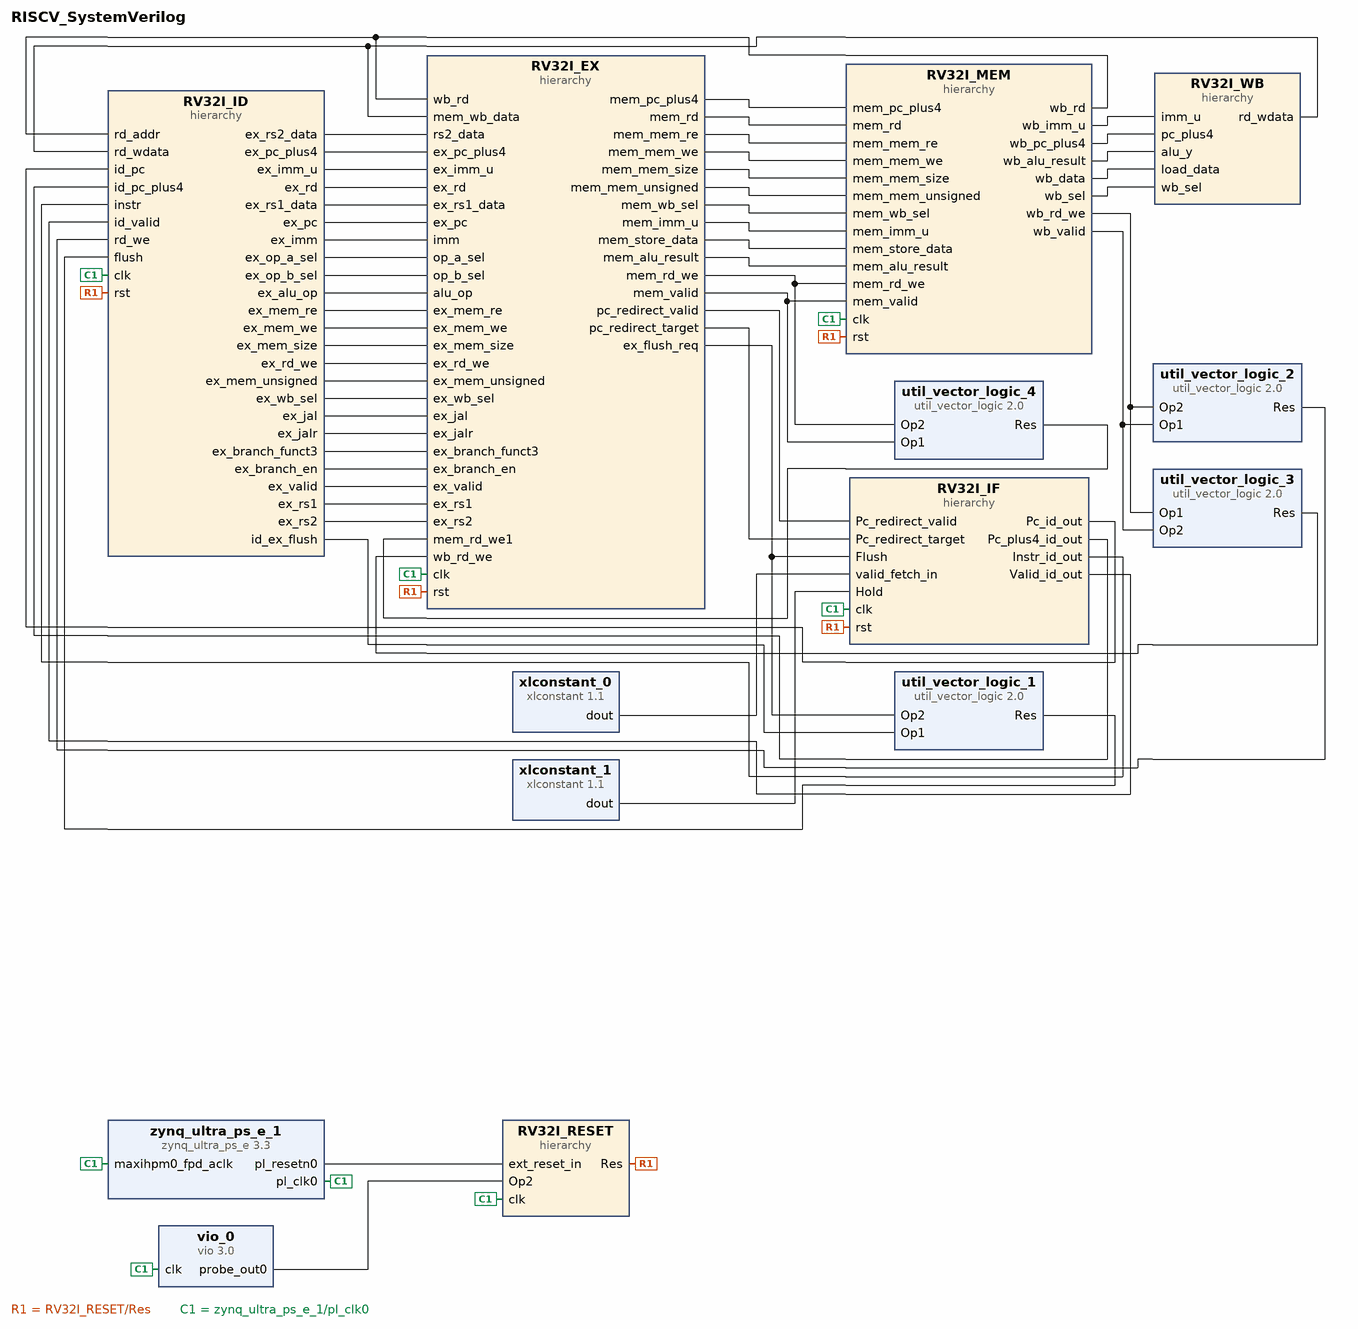
[diagram p0: block diagram of the top level]
# Vivado block design RISCV_SystemVerilog, xczu5ev-sfvc784-2-i, Vivado 2020.1
create_bd_design RISCV_SystemVerilog

create_bd_cell -type hier RV32I_IF
create_bd_cell -type hier RV32I_ID
create_bd_cell -type ip -vlnv xilinx.com:ip:xlconstant:1.1 xlconstant_0
create_bd_cell -type hier RV32I_EX
create_bd_cell -type hier RV32I_MEM
create_bd_cell -type hier RV32I_WB
create_bd_cell -type hier RV32I_RESET
create_bd_cell -type ip -vlnv xilinx.com:ip:zynq_ultra_ps_e:3.3 zynq_ultra_ps_e_1
set_property -dict [list \
  CONFIG.CAN0_BOARD_INTERFACE custom \
  CONFIG.CAN1_BOARD_INTERFACE custom \
  CONFIG.CSU_BOARD_INTERFACE custom \
  CONFIG.DP_BOARD_INTERFACE custom \
  CONFIG.GEM0_BOARD_INTERFACE custom \
  CONFIG.GEM1_BOARD_INTERFACE custom \
  CONFIG.GEM2_BOARD_INTERFACE custom \
  CONFIG.GEM3_BOARD_INTERFACE custom \
  CONFIG.GPIO_BOARD_INTERFACE custom \
  CONFIG.IIC0_BOARD_INTERFACE custom \
  CONFIG.IIC1_BOARD_INTERFACE custom \
  CONFIG.NAND_BOARD_INTERFACE custom \
  CONFIG.PCIE_BOARD_INTERFACE custom \
  CONFIG.PJTAG_BOARD_INTERFACE custom \
  CONFIG.PMU_BOARD_INTERFACE custom \
  CONFIG.PSU_BANK_0_IO_STANDARD LVCMOS18 \
  CONFIG.PSU_BANK_1_IO_STANDARD LVCMOS18 \
  CONFIG.PSU_BANK_2_IO_STANDARD LVCMOS18 \
  CONFIG.PSU_BANK_3_IO_STANDARD LVCMOS18 \
  CONFIG.PSU_USB3__DUAL_CLOCK_ENABLE 1 \
  CONFIG.PSU__CAN0__PERIPHERAL__ENABLE 1 \
  CONFIG.PSU__CAN0__PERIPHERAL__IO EMIO \
  CONFIG.PSU__CAN1__PERIPHERAL__ENABLE 0 \
  CONFIG.PSU__CRF_APB__ACPU_CTRL__FREQMHZ 1200 \
  CONFIG.PSU__CRF_APB__ACPU_CTRL__SRCSEL APLL \
  CONFIG.PSU__CRF_APB__APLL_CTRL__SRCSEL PSS_REF_CLK \
  CONFIG.PSU__CRF_APB__DBG_FPD_CTRL__FREQMHZ 250 \
  CONFIG.PSU__CRF_APB__DBG_FPD_CTRL__SRCSEL IOPLL \
  CONFIG.PSU__CRF_APB__DBG_TRACE_CTRL__FREQMHZ 250 \
  CONFIG.PSU__CRF_APB__DBG_TRACE_CTRL__SRCSEL IOPLL \
  CONFIG.PSU__CRF_APB__DBG_TSTMP_CTRL__FREQMHZ 250 \
  CONFIG.PSU__CRF_APB__DBG_TSTMP_CTRL__SRCSEL IOPLL \
  CONFIG.PSU__CRF_APB__DDR_CTRL__FREQMHZ 1200 \
  CONFIG.PSU__CRF_APB__DDR_CTRL__SRCSEL DPLL \
  CONFIG.PSU__CRF_APB__DPDMA_REF_CTRL__FREQMHZ 600 \
  CONFIG.PSU__CRF_APB__DPDMA_REF_CTRL__SRCSEL DPLL \
  CONFIG.PSU__CRF_APB__DPLL_CTRL__SRCSEL PSS_REF_CLK \
  CONFIG.PSU__CRF_APB__DP_AUDIO_REF_CTRL__SRCSEL RPLL \
  CONFIG.PSU__CRF_APB__DP_STC_REF_CTRL__SRCSEL RPLL \
  CONFIG.PSU__CRF_APB__DP_VIDEO_REF_CTRL__SRCSEL VPLL \
  CONFIG.PSU__CRF_APB__GDMA_REF_CTRL__FREQMHZ 600 \
  CONFIG.PSU__CRF_APB__GDMA_REF_CTRL__SRCSEL DPLL \
  CONFIG.PSU__CRF_APB__GPU_REF_CTRL__FREQMHZ 600 \
  CONFIG.PSU__CRF_APB__GPU_REF_CTRL__SRCSEL DPLL \
  CONFIG.PSU__CRF_APB__TOPSW_LSBUS_CTRL__FREQMHZ 100 \
  CONFIG.PSU__CRF_APB__TOPSW_LSBUS_CTRL__SRCSEL IOPLL \
  CONFIG.PSU__CRF_APB__TOPSW_MAIN_CTRL__FREQMHZ 533.333 \
  CONFIG.PSU__CRF_APB__TOPSW_MAIN_CTRL__SRCSEL DPLL \
  CONFIG.PSU__CRF_APB__VPLL_CTRL__SRCSEL PSS_REF_CLK \
  CONFIG.PSU__CRL_APB__ADMA_REF_CTRL__FREQMHZ 500 \
  CONFIG.PSU__CRL_APB__ADMA_REF_CTRL__SRCSEL IOPLL \
  CONFIG.PSU__CRL_APB__CAN1_REF_CTRL__FREQMHZ 100 \
  CONFIG.PSU__CRL_APB__CAN1_REF_CTRL__SRCSEL IOPLL \
  CONFIG.PSU__CRL_APB__CPU_R5_CTRL__FREQMHZ 500 \
  CONFIG.PSU__CRL_APB__CPU_R5_CTRL__SRCSEL IOPLL \
  CONFIG.PSU__CRL_APB__DBG_LPD_CTRL__FREQMHZ 250 \
  CONFIG.PSU__CRL_APB__DBG_LPD_CTRL__SRCSEL IOPLL \
  CONFIG.PSU__CRL_APB__GEM3_REF_CTRL__FREQMHZ 125 \
  CONFIG.PSU__CRL_APB__GEM3_REF_CTRL__SRCSEL IOPLL \
  CONFIG.PSU__CRL_APB__I2C0_REF_CTRL__FREQMHZ 100 \
  CONFIG.PSU__CRL_APB__I2C0_REF_CTRL__SRCSEL IOPLL \
  CONFIG.PSU__CRL_APB__I2C1_REF_CTRL__FREQMHZ 100 \
  CONFIG.PSU__CRL_APB__I2C1_REF_CTRL__SRCSEL IOPLL \
  CONFIG.PSU__CRL_APB__IOPLL_CTRL__SRCSEL PSS_REF_CLK \
  CONFIG.PSU__CRL_APB__IOU_SWITCH_CTRL__FREQMHZ 267 \
  CONFIG.PSU__CRL_APB__IOU_SWITCH_CTRL__SRCSEL RPLL \
  CONFIG.PSU__CRL_APB__LPD_LSBUS_CTRL__FREQMHZ 100 \
  CONFIG.PSU__CRL_APB__LPD_LSBUS_CTRL__SRCSEL IOPLL \
  CONFIG.PSU__CRL_APB__LPD_SWITCH_CTRL__FREQMHZ 500 \
  CONFIG.PSU__CRL_APB__LPD_SWITCH_CTRL__SRCSEL IOPLL \
  CONFIG.PSU__CRL_APB__PCAP_CTRL__FREQMHZ 200 \
  CONFIG.PSU__CRL_APB__PCAP_CTRL__SRCSEL IOPLL \
  CONFIG.PSU__CRL_APB__PL0_REF_CTRL__FREQMHZ 10 \
  CONFIG.PSU__CRL_APB__PL0_REF_CTRL__SRCSEL RPLL \
  CONFIG.PSU__CRL_APB__PL1_REF_CTRL__FREQMHZ 10 \
  CONFIG.PSU__CRL_APB__QSPI_REF_CTRL__FREQMHZ 300 \
  CONFIG.PSU__CRL_APB__QSPI_REF_CTRL__SRCSEL IOPLL \
  CONFIG.PSU__CRL_APB__RPLL_CTRL__SRCSEL PSS_REF_CLK \
  CONFIG.PSU__CRL_APB__SDIO1_REF_CTRL__FREQMHZ 200 \
  CONFIG.PSU__CRL_APB__SDIO1_REF_CTRL__SRCSEL RPLL \
  CONFIG.PSU__CRL_APB__TIMESTAMP_REF_CTRL__FREQMHZ 100 \
  CONFIG.PSU__CRL_APB__TIMESTAMP_REF_CTRL__SRCSEL PSS_REF_CLK \
  CONFIG.PSU__CRL_APB__UART0_REF_CTRL__FREQMHZ 100 \
  CONFIG.PSU__CRL_APB__UART0_REF_CTRL__SRCSEL IOPLL \
  CONFIG.PSU__CRL_APB__UART1_REF_CTRL__FREQMHZ 100 \
  CONFIG.PSU__CRL_APB__UART1_REF_CTRL__SRCSEL IOPLL \
  CONFIG.PSU__CRL_APB__USB0_BUS_REF_CTRL__FREQMHZ 250 \
  CONFIG.PSU__CRL_APB__USB0_BUS_REF_CTRL__SRCSEL IOPLL \
  CONFIG.PSU__CRL_APB__USB3_DUAL_REF_CTRL__FREQMHZ 20 \
  CONFIG.PSU__CRL_APB__USB3_DUAL_REF_CTRL__SRCSEL IOPLL \
  CONFIG.PSU__CRL_APB__USB3__ENABLE 1 \
  CONFIG.PSU__CSUPMU__PERIPHERAL__VALID 0 \
  CONFIG.PSU__DDRC__BUS_WIDTH {64 Bit} \
  CONFIG.PSU__DDRC__COMPONENTS Components \
  CONFIG.PSU__DDRC__DEVICE_CAPACITY {8192 MBits} \
  CONFIG.PSU__DDRC__DRAM_WIDTH {16 Bits} \
  CONFIG.PSU__DDRC__ECC Disabled \
  CONFIG.PSU__DDRC__MEMORY_TYPE {DDR 4} \
  CONFIG.PSU__DDRC__SPEED_BIN DDR4_2400R \
  CONFIG.PSU__DDR_HIGH_ADDRESS_GUI_ENABLE 1 \
  CONFIG.PSU__DDR__INTERFACE__FREQMHZ 600.000 \
  CONFIG.PSU__DEVICE_TYPE EV \
  CONFIG.PSU__DISPLAYPORT__LANE0__ENABLE 1 \
  CONFIG.PSU__DISPLAYPORT__LANE0__IO {GT Lane3} \
  CONFIG.PSU__DISPLAYPORT__LANE1__ENABLE 0 \
  CONFIG.PSU__DISPLAYPORT__PERIPHERAL__ENABLE 1 \
  CONFIG.PSU__DLL__ISUSED 1 \
  CONFIG.PSU__DPAUX__PERIPHERAL__ENABLE 1 \
  CONFIG.PSU__DPAUX__PERIPHERAL__IO {MIO 27 .. 30} \
  CONFIG.PSU__DP__LANE_SEL {Single Higher} \
  CONFIG.PSU__DP__REF_CLK_FREQ 108 \
  CONFIG.PSU__DP__REF_CLK_SEL {Ref Clk3} \
  CONFIG.PSU__ENET3__FIFO__ENABLE 0 \
  CONFIG.PSU__ENET3__GRP_MDIO__ENABLE 1 \
  CONFIG.PSU__ENET3__GRP_MDIO__IO {MIO 76 .. 77} \
  CONFIG.PSU__ENET3__PERIPHERAL__ENABLE 1 \
  CONFIG.PSU__ENET3__PERIPHERAL__IO {MIO 64 .. 75} \
  CONFIG.PSU__ENET3__PTP__ENABLE 0 \
  CONFIG.PSU__ENET3__TSU__ENABLE 0 \
  CONFIG.PSU__FPGA_PL0_ENABLE 1 \
  CONFIG.PSU__FPGA_PL1_ENABLE 1 \
  CONFIG.PSU__GEM3_COHERENCY 0 \
  CONFIG.PSU__GEM3_ROUTE_THROUGH_FPD 0 \
  CONFIG.PSU__GEM__TSU__ENABLE 0 \
  CONFIG.PSU__GPIO0_MIO__IO {MIO 0 .. 25} \
  CONFIG.PSU__GPIO0_MIO__PERIPHERAL__ENABLE 1 \
  CONFIG.PSU__GPIO1_MIO__IO {MIO 26 .. 51} \
  CONFIG.PSU__GPIO1_MIO__PERIPHERAL__ENABLE 1 \
  CONFIG.PSU__GPIO_EMIO_WIDTH 95 \
  CONFIG.PSU__GPIO_EMIO__PERIPHERAL__ENABLE 1 \
  CONFIG.PSU__GPIO_EMIO__PERIPHERAL__IO 95 \
  CONFIG.PSU__GT__LINK_SPEED HBR \
  CONFIG.PSU__GT__PRE_EMPH_LVL_4 0 \
  CONFIG.PSU__GT__VLT_SWNG_LVL_4 0 \
  CONFIG.PSU__I2C0__PERIPHERAL__ENABLE 1 \
  CONFIG.PSU__I2C0__PERIPHERAL__IO EMIO \
  CONFIG.PSU__I2C1__PERIPHERAL__ENABLE 1 \
  CONFIG.PSU__I2C1__PERIPHERAL__IO {MIO 24 .. 25} \
  CONFIG.PSU__IOU_SLCR__IOU_TTC_APB_CLK__TTC0_SEL APB \
  CONFIG.PSU__IOU_SLCR__IOU_TTC_APB_CLK__TTC1_SEL APB \
  CONFIG.PSU__IOU_SLCR__IOU_TTC_APB_CLK__TTC2_SEL APB \
  CONFIG.PSU__IOU_SLCR__IOU_TTC_APB_CLK__TTC3_SEL APB \
  CONFIG.PSU__LPD_SLCR__CSUPMU__FREQMHZ 100 \
  CONFIG.PSU__MAXIGP0__DATA_WIDTH 32 \
  CONFIG.PSU__OVERRIDE_HPX_QOS 0 \
  CONFIG.PSU__OVERRIDE__BASIC_CLOCK 0 \
  CONFIG.PSU__PMU__PERIPHERAL__ENABLE 0 \
  CONFIG.PSU__PRESET_APPLIED 0 \
  CONFIG.PSU__PSS_REF_CLK__FREQMHZ 33.333 \
  CONFIG.PSU__QSPI_COHERENCY 0 \
  CONFIG.PSU__QSPI_ROUTE_THROUGH_FPD 0 \
  CONFIG.PSU__QSPI__GRP_FBCLK__ENABLE 0 \
  CONFIG.PSU__QSPI__PERIPHERAL__DATA_MODE x4 \
  CONFIG.PSU__QSPI__PERIPHERAL__ENABLE 1 \
  CONFIG.PSU__QSPI__PERIPHERAL__IO {MIO 0 .. 12} \
  CONFIG.PSU__QSPI__PERIPHERAL__MODE {Dual Parallel} \
  CONFIG.PSU__SATA__LANE1__IO {GT Lane1} \
  CONFIG.PSU__SATA__PERIPHERAL__ENABLE 1 \
  CONFIG.PSU__SATA__REF_CLK_FREQ 125 \
  CONFIG.PSU__SATA__REF_CLK_SEL {Ref Clk1} \
  CONFIG.PSU__SD0__DATA_TRANSFER_MODE 8Bit \
  CONFIG.PSU__SD0__GRP_POW__ENABLE 1 \
  CONFIG.PSU__SD0__GRP_POW__IO {MIO 23} \
  CONFIG.PSU__SD0__PERIPHERAL__ENABLE 1 \
  CONFIG.PSU__SD0__PERIPHERAL__IO {MIO 13 .. 22} \
  CONFIG.PSU__SD0__RESET__ENABLE 1 \
  CONFIG.PSU__SD0__SLOT_TYPE eMMC \
  CONFIG.PSU__SD1_COHERENCY 0 \
  CONFIG.PSU__SD1_ROUTE_THROUGH_FPD 0 \
  CONFIG.PSU__SD1__DATA_TRANSFER_MODE 4Bit \
  CONFIG.PSU__SD1__GRP_CD__ENABLE 1 \
  CONFIG.PSU__SD1__GRP_CD__IO {MIO 45} \
  CONFIG.PSU__SD1__GRP_POW__ENABLE 0 \
  CONFIG.PSU__SD1__GRP_WP__ENABLE 1 \
  CONFIG.PSU__SD1__GRP_WP__IO {MIO 44} \
  CONFIG.PSU__SD1__PERIPHERAL__ENABLE 1 \
  CONFIG.PSU__SD1__PERIPHERAL__IO {MIO 46 .. 51} \
  CONFIG.PSU__SD1__SLOT_TYPE {SD 2.0} \
  CONFIG.PSU__SWDT0__CLOCK__ENABLE 0 \
  CONFIG.PSU__SWDT0__PERIPHERAL__ENABLE 1 \
  CONFIG.PSU__SWDT0__RESET__ENABLE 0 \
  CONFIG.PSU__SWDT1__CLOCK__ENABLE 0 \
  CONFIG.PSU__SWDT1__PERIPHERAL__ENABLE 1 \
  CONFIG.PSU__SWDT1__RESET__ENABLE 0 \
  CONFIG.PSU__TSU__BUFG_PORT_PAIR 0 \
  CONFIG.PSU__TTC0__CLOCK__ENABLE 0 \
  CONFIG.PSU__TTC0__PERIPHERAL__ENABLE 1 \
  CONFIG.PSU__TTC0__WAVEOUT__ENABLE 0 \
  CONFIG.PSU__TTC1__CLOCK__ENABLE 0 \
  CONFIG.PSU__TTC1__PERIPHERAL__ENABLE 1 \
  CONFIG.PSU__TTC1__WAVEOUT__ENABLE 0 \
  CONFIG.PSU__TTC2__CLOCK__ENABLE 0 \
  CONFIG.PSU__TTC2__PERIPHERAL__ENABLE 1 \
  CONFIG.PSU__TTC2__WAVEOUT__ENABLE 0 \
  CONFIG.PSU__TTC3__CLOCK__ENABLE 0 \
  CONFIG.PSU__TTC3__PERIPHERAL__ENABLE 1 \
  CONFIG.PSU__TTC3__WAVEOUT__ENABLE 0 \
  CONFIG.PSU__UART0__BAUD_RATE 115200 \
  CONFIG.PSU__UART0__MODEM__ENABLE 0 \
  CONFIG.PSU__UART0__PERIPHERAL__ENABLE 1 \
  CONFIG.PSU__UART0__PERIPHERAL__IO {MIO 34 .. 35} \
  CONFIG.PSU__UART1__PERIPHERAL__ENABLE 0 \
  CONFIG.PSU__USB0_COHERENCY 0 \
  CONFIG.PSU__USB0__PERIPHERAL__ENABLE 1 \
  CONFIG.PSU__USB0__PERIPHERAL__IO {MIO 52 .. 63} \
  CONFIG.PSU__USB0__REF_CLK_FREQ 52 \
  CONFIG.PSU__USB0__REF_CLK_SEL {Ref Clk2} \
  CONFIG.PSU__USB2_0__EMIO__ENABLE 0 \
  CONFIG.PSU__USB3_0__EMIO__ENABLE 0 \
  CONFIG.PSU__USB3_0__PERIPHERAL__ENABLE 1 \
  CONFIG.PSU__USB3_0__PERIPHERAL__IO {GT Lane2} \
  CONFIG.PSU__USB__RESET__MODE {Boot Pin} \
  CONFIG.PSU__USB__RESET__POLARITY {Active Low} \
  CONFIG.PSU__USE__IRQ0 0 \
  CONFIG.PSU__USE__M_AXI_GP0 1 \
  CONFIG.PSU__USE__M_AXI_GP1 0 \
  CONFIG.PSU__USE__M_AXI_GP2 0 \
  CONFIG.QSPI_BOARD_INTERFACE custom \
  CONFIG.SATA_BOARD_INTERFACE custom \
  CONFIG.SD0_BOARD_INTERFACE custom \
  CONFIG.SD1_BOARD_INTERFACE custom \
  CONFIG.SPI0_BOARD_INTERFACE custom \
  CONFIG.SPI1_BOARD_INTERFACE custom \
  CONFIG.SUBPRESET1 Custom \
  CONFIG.SUBPRESET2 Custom \
  CONFIG.SWDT0_BOARD_INTERFACE custom \
  CONFIG.SWDT1_BOARD_INTERFACE custom \
  CONFIG.TRACE_BOARD_INTERFACE custom \
  CONFIG.TTC0_BOARD_INTERFACE custom \
  CONFIG.TTC1_BOARD_INTERFACE custom \
  CONFIG.TTC2_BOARD_INTERFACE custom \
  CONFIG.TTC3_BOARD_INTERFACE custom \
  CONFIG.UART0_BOARD_INTERFACE custom \
  CONFIG.UART1_BOARD_INTERFACE custom \
  CONFIG.USB0_BOARD_INTERFACE custom \
  CONFIG.USB1_BOARD_INTERFACE custom \
] [get_bd_cells zynq_ultra_ps_e_1]
# 740 more settings of zynq_ultra_ps_e_1 are not shown: defaults, MIO pin electricals, DDR timing, and values the tool derives
create_bd_cell -type ip -vlnv xilinx.com:ip:util_vector_logic:2.0 util_vector_logic_1
set_property -dict {CONFIG.C_OPERATION or CONFIG.C_SIZE 1} [get_bd_cells util_vector_logic_1]
create_bd_cell -type ip -vlnv xilinx.com:ip:vio:3.0 vio_0
set_property -dict {CONFIG.C_NUM_PROBE_IN 0} [get_bd_cells vio_0]
create_bd_cell -type ip -vlnv xilinx.com:ip:util_vector_logic:2.0 util_vector_logic_2
set_property -dict {CONFIG.C_OPERATION and CONFIG.C_SIZE 1} [get_bd_cells util_vector_logic_2]
create_bd_cell -type ip -vlnv xilinx.com:ip:util_vector_logic:2.0 util_vector_logic_3
set_property -dict {CONFIG.C_OPERATION or CONFIG.C_SIZE 1} [get_bd_cells util_vector_logic_3]
create_bd_cell -type ip -vlnv xilinx.com:ip:util_vector_logic:2.0 util_vector_logic_4
set_property -dict {CONFIG.C_OPERATION or CONFIG.C_SIZE 1} [get_bd_cells util_vector_logic_4]
create_bd_cell -type ip -vlnv xilinx.com:ip:xlconstant:1.1 xlconstant_1
set_property -dict {CONFIG.CONST_VAL 0} [get_bd_cells xlconstant_1]

# ---- hierarchy /RV32I_IF ----
current_bd_instance /RV32I_IF
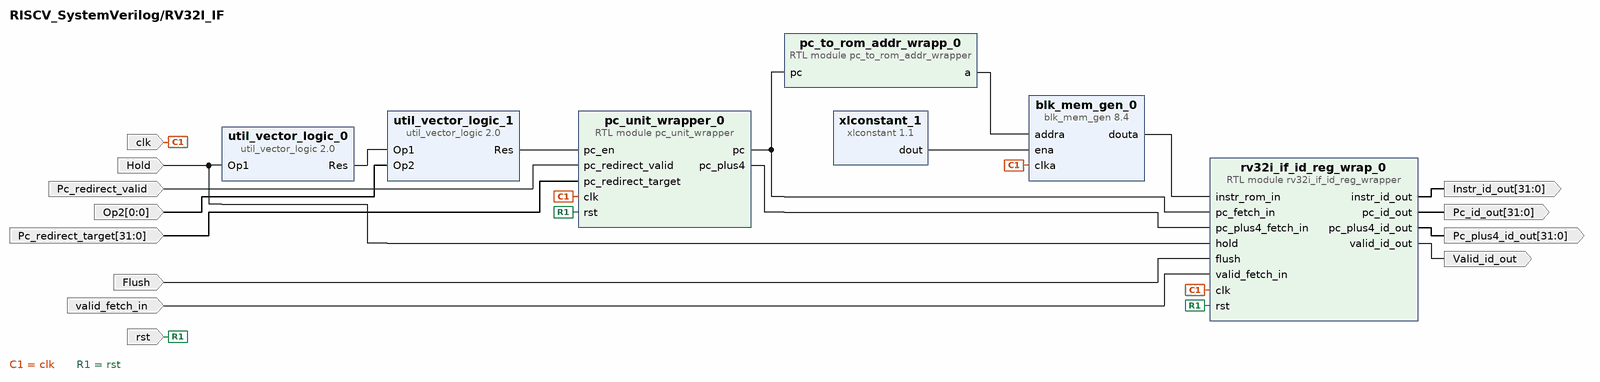
[diagram p1: block diagram inside /RV32I_IF]
create_bd_pin -dir I Hold
create_bd_pin -dir I Flush
create_bd_pin -dir O -from 31 -to 0 Pc_id_out
create_bd_pin -dir O -from 31 -to 0 Pc_plus4_id_out
create_bd_pin -dir O -from 31 -to 0 Instr_id_out
create_bd_pin -dir O Valid_id_out
create_bd_pin -dir I Pc_redirect_valid
create_bd_pin -dir I -from 31 -to 0 Pc_redirect_target
create_bd_pin -dir I -type clk clk
create_bd_pin -dir I -type rst rst
create_bd_pin -dir I valid_fetch_in
create_bd_pin -dir I -from 0 -to 0 Op2

create_bd_cell -type ip -vlnv xilinx.com:ip:util_vector_logic:2.0 util_vector_logic_0
set_property -dict {CONFIG.C_OPERATION not CONFIG.C_SIZE 1} [get_bd_cells util_vector_logic_0]
create_bd_cell -type module -reference pc_to_rom_addr_wrapper pc_to_rom_addr_wrapp_0
set_property -dict {CONFIG.ADDR_W 11} [get_bd_cells pc_to_rom_addr_wrapp_0]
create_bd_cell -type ip -vlnv xilinx.com:ip:blk_mem_gen:8.4 blk_mem_gen_0
set_property -dict [list \
  CONFIG.Additional_Inputs_for_Power_Estimation true \
  CONFIG.Coe_File ../../../../../../../../rv32i_vscode/prog_asm.coe \
  CONFIG.Enable_32bit_Address false \
  CONFIG.Fill_Remaining_Memory_Locations true \
  CONFIG.Load_Init_File true \
  CONFIG.Memory_Type Single_Port_ROM \
  CONFIG.Port_A_Clock 10 \
  CONFIG.Port_A_Enable_Rate 10 \
  CONFIG.Port_A_Write_Rate 0 \
  CONFIG.Port_B_Clock 0 \
  CONFIG.Port_B_Enable_Rate 0 \
  CONFIG.Port_B_Write_Rate 0 \
  CONFIG.Register_PortA_Output_of_Memory_Primitives false \
  CONFIG.Use_RSTA_Pin false \
  CONFIG.use_bram_block Stand_Alone \
] [get_bd_cells blk_mem_gen_0]
create_bd_cell -type module -reference pc_unit_wrapper pc_unit_wrapper_0
create_bd_cell -type ip -vlnv xilinx.com:ip:util_vector_logic:2.0 util_vector_logic_1
set_property -dict {CONFIG.C_OPERATION or CONFIG.C_SIZE 1} [get_bd_cells util_vector_logic_1]
create_bd_cell -type ip -vlnv xilinx.com:ip:xlconstant:1.1 xlconstant_1
create_bd_cell -type module -reference rv32i_if_id_reg_wrapper rv32i_if_id_reg_wrap_0

# ---- hierarchy /RV32I_ID ----
current_bd_instance /RV32I_ID
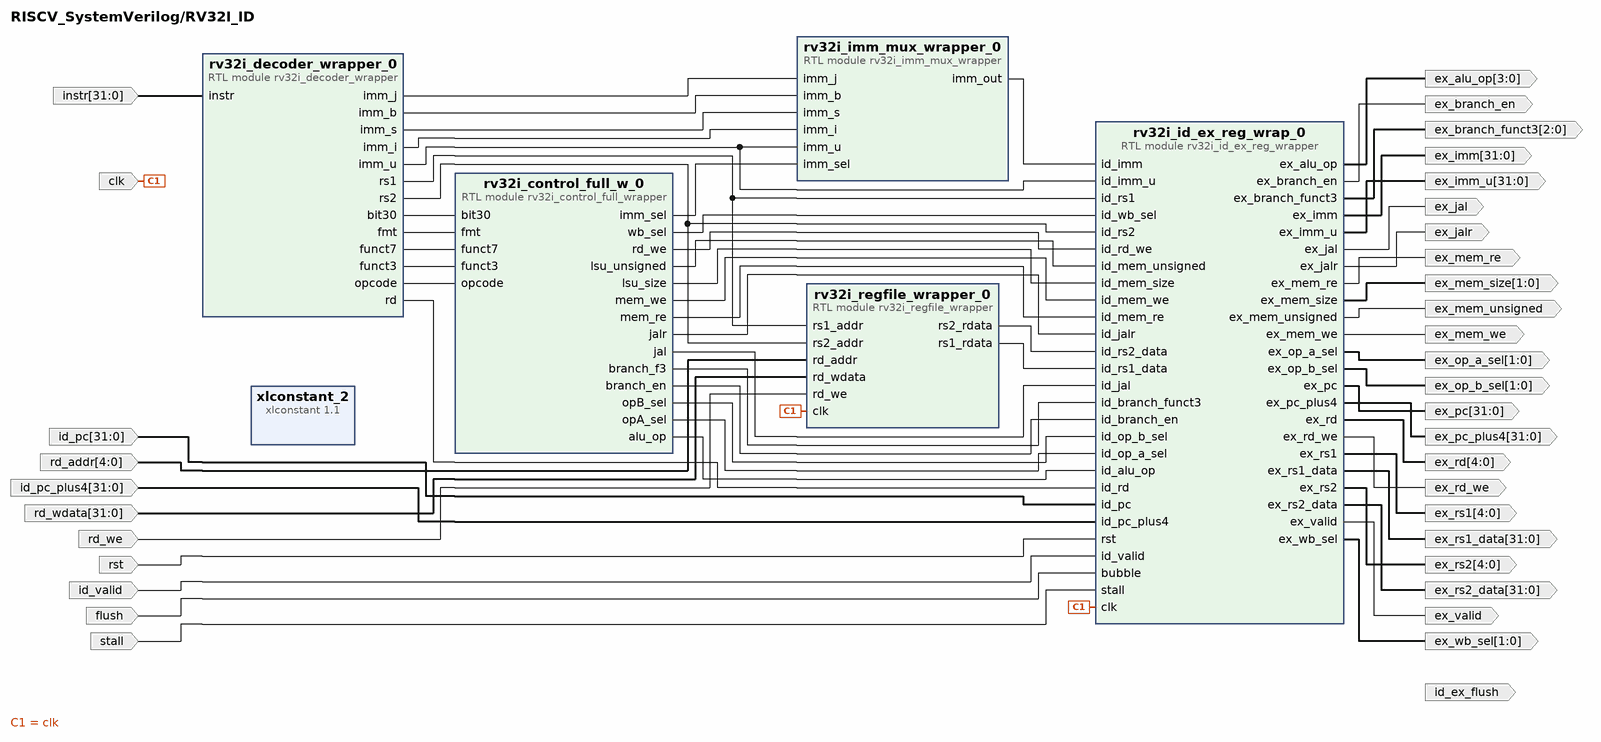
[diagram p2: block diagram inside /RV32I_ID]
create_bd_pin -dir I -from 31 -to 0 id_pc
create_bd_pin -dir I -from 31 -to 0 id_pc_plus4
create_bd_pin -dir I -from 31 -to 0 instr
create_bd_pin -dir I -type clk clk
create_bd_pin -dir I -type rst rst
create_bd_pin -dir O -from 31 -to 0 ex_pc_plus4
create_bd_pin -dir O -from 31 -to 0 ex_imm_u
create_bd_pin -dir O -from 4 -to 0 ex_rd
create_bd_pin -dir O -from 31 -to 0 ex_rs1_data
create_bd_pin -dir O -from 31 -to 0 ex_rs2_data
create_bd_pin -dir O -from 31 -to 0 ex_pc
create_bd_pin -dir O -from 31 -to 0 ex_imm
create_bd_pin -dir O -from 1 -to 0 ex_op_a_sel
create_bd_pin -dir O -from 1 -to 0 ex_op_b_sel
create_bd_pin -dir O -from 3 -to 0 ex_alu_op
create_bd_pin -dir O ex_mem_re
create_bd_pin -dir O ex_mem_we
create_bd_pin -dir O -from 1 -to 0 ex_mem_size
create_bd_pin -dir O ex_rd_we
create_bd_pin -dir O ex_mem_unsigned
create_bd_pin -dir O -from 1 -to 0 ex_wb_sel
create_bd_pin -dir O ex_jal
create_bd_pin -dir O ex_jalr
create_bd_pin -dir O -from 2 -to 0 ex_branch_funct3
create_bd_pin -dir O ex_branch_en
create_bd_pin -dir I id_valid
create_bd_pin -dir O ex_valid
create_bd_pin -dir I -from 4 -to 0 rd_addr
create_bd_pin -dir I -from 31 -to 0 rd_wdata
create_bd_pin -dir I rd_we
create_bd_pin -dir I flush
create_bd_pin -dir I stall
create_bd_pin -dir O id_ex_flush
create_bd_pin -dir O -from 4 -to 0 ex_rs1
create_bd_pin -dir O -from 4 -to 0 ex_rs2

create_bd_cell -type module -reference rv32i_imm_mux_wrapper rv32i_imm_mux_wrapper_0
create_bd_cell -type module -reference rv32i_decoder_wrapper rv32i_decoder_wrapper_0
create_bd_cell -type module -reference rv32i_control_full_wrapper rv32i_control_full_w_0
create_bd_cell -type module -reference rv32i_regfile_wrapper rv32i_regfile_wrapper_0
create_bd_cell -type module -reference rv32i_id_ex_reg_wrapper rv32i_id_ex_reg_wrap_0
create_bd_cell -type ip -vlnv xilinx.com:ip:xlconstant:1.1 xlconstant_2
set_property -dict {CONFIG.CONST_VAL 0} [get_bd_cells xlconstant_2]

# ---- hierarchy /RV32I_EX ----
current_bd_instance /RV32I_EX
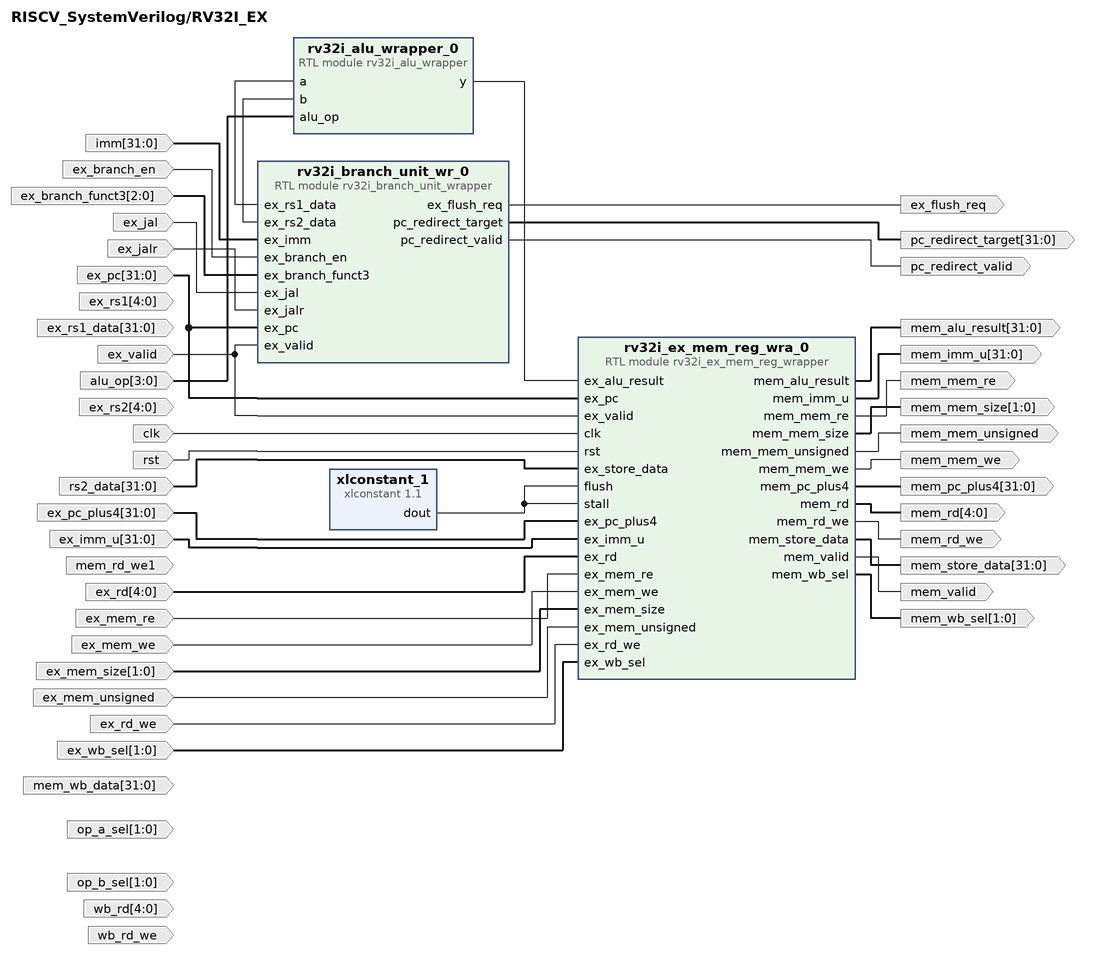
[diagram p3: block diagram inside /RV32I_EX]
create_bd_pin -dir I -from 31 -to 0 ex_rs1_data
create_bd_pin -dir I -from 31 -to 0 ex_pc
create_bd_pin -dir I -from 1 -to 0 op_a_sel
create_bd_pin -dir I -type clk clk
create_bd_pin -dir I -type rst rst
create_bd_pin -dir I ex_valid
create_bd_pin -dir I -from 31 -to 0 rs2_data
create_bd_pin -dir I -from 31 -to 0 ex_pc_plus4
create_bd_pin -dir I -from 31 -to 0 ex_imm_u
create_bd_pin -dir I -from 4 -to 0 ex_rd
create_bd_pin -dir I ex_mem_re
create_bd_pin -dir I ex_mem_we
create_bd_pin -dir I -from 1 -to 0 ex_mem_size
create_bd_pin -dir I ex_mem_unsigned
create_bd_pin -dir I ex_rd_we
create_bd_pin -dir I -from 1 -to 0 ex_wb_sel
create_bd_pin -dir I -from 31 -to 0 imm
create_bd_pin -dir I ex_branch_en
create_bd_pin -dir I -from 2 -to 0 ex_branch_funct3
create_bd_pin -dir I ex_jal
create_bd_pin -dir I ex_jalr
create_bd_pin -dir I -from 1 -to 0 op_b_sel
create_bd_pin -dir I -from 3 -to 0 alu_op
create_bd_pin -dir O pc_redirect_valid
create_bd_pin -dir O -from 31 -to 0 pc_redirect_target
create_bd_pin -dir O -from 31 -to 0 mem_pc_plus4
create_bd_pin -dir O -from 4 -to 0 mem_rd
create_bd_pin -dir O mem_mem_re
create_bd_pin -dir O mem_mem_we
create_bd_pin -dir O -from 1 -to 0 mem_mem_size
create_bd_pin -dir O mem_mem_unsigned
create_bd_pin -dir O mem_rd_we
create_bd_pin -dir O -from 1 -to 0 mem_wb_sel
create_bd_pin -dir O -from 31 -to 0 mem_imm_u
create_bd_pin -dir O -from 31 -to 0 mem_store_data
create_bd_pin -dir O -from 31 -to 0 mem_alu_result
create_bd_pin -dir O ex_flush_req
create_bd_pin -dir I -from 31 -to 0 mem_wb_data
create_bd_pin -dir I -from 4 -to 0 ex_rs1
create_bd_pin -dir I -from 4 -to 0 ex_rs2
create_bd_pin -dir I -from 4 -to 0 wb_rd
create_bd_pin -dir I wb_rd_we
create_bd_pin -dir O mem_valid
create_bd_pin -dir I mem_rd_we1

create_bd_cell -type module -reference rv32i_branch_unit_wrapper rv32i_branch_unit_wr_0
create_bd_cell -type module -reference rv32i_ex_mem_reg_wrapper rv32i_ex_mem_reg_wra_0
create_bd_cell -type module -reference rv32i_alu_wrapper rv32i_alu_wrapper_0
create_bd_cell -type ip -vlnv xilinx.com:ip:xlconstant:1.1 xlconstant_1
set_property -dict {CONFIG.CONST_VAL 0} [get_bd_cells xlconstant_1]

# ---- hierarchy /RV32I_MEM ----
current_bd_instance /RV32I_MEM
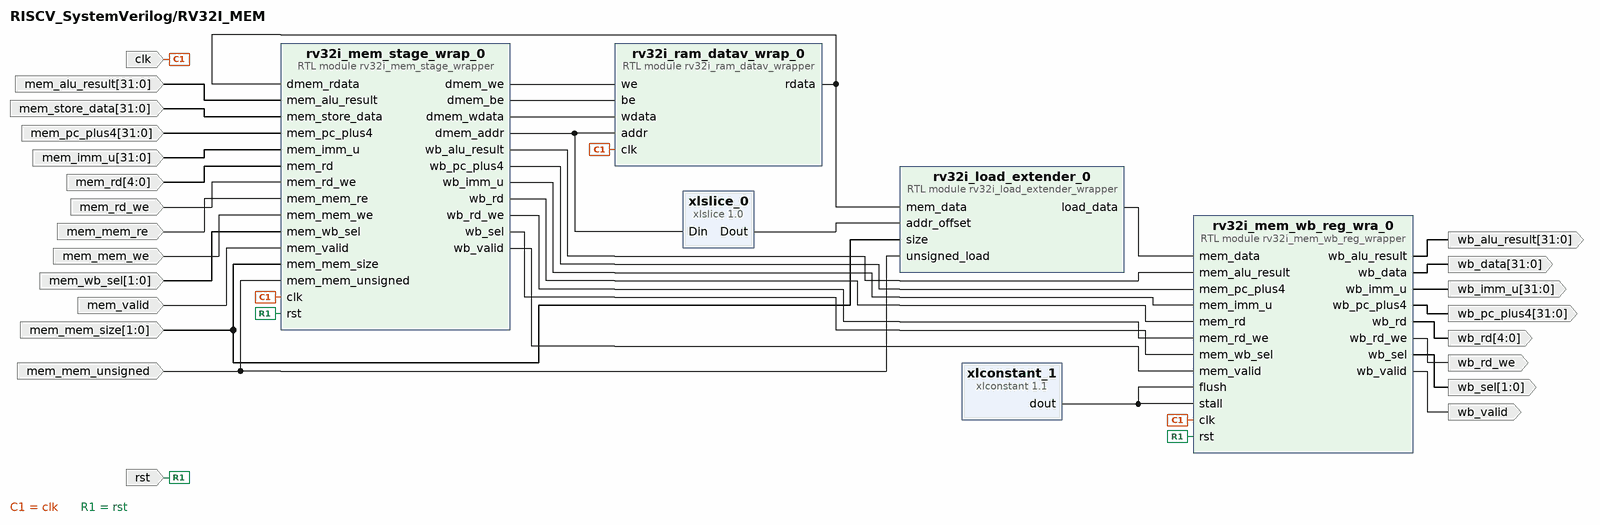
[diagram p4: block diagram inside /RV32I_MEM]
create_bd_pin -dir I -from 31 -to 0 mem_alu_result
create_bd_pin -dir I -from 31 -to 0 mem_store_data
create_bd_pin -dir I -from 31 -to 0 mem_pc_plus4
create_bd_pin -dir I -from 31 -to 0 mem_imm_u
create_bd_pin -dir I -from 4 -to 0 mem_rd
create_bd_pin -dir I mem_rd_we
create_bd_pin -dir I mem_mem_re
create_bd_pin -dir I mem_mem_we
create_bd_pin -dir I -from 1 -to 0 mem_mem_size
create_bd_pin -dir I mem_mem_unsigned
create_bd_pin -dir I -from 1 -to 0 mem_wb_sel
create_bd_pin -dir O -from 31 -to 0 wb_imm_u
create_bd_pin -dir O -from 31 -to 0 wb_pc_plus4
create_bd_pin -dir O -from 31 -to 0 wb_alu_result
create_bd_pin -dir O -from 31 -to 0 wb_data
create_bd_pin -dir O -from 1 -to 0 wb_sel
create_bd_pin -dir I -type clk clk
create_bd_pin -dir O -from 4 -to 0 wb_rd
create_bd_pin -dir O wb_rd_we
create_bd_pin -dir I -type rst rst
create_bd_pin -dir I mem_valid
create_bd_pin -dir O wb_valid

create_bd_cell -type ip -vlnv xilinx.com:ip:xlslice:1.0 xlslice_0
set_property -dict {CONFIG.DIN_FROM 1 CONFIG.DIN_TO 0 CONFIG.DOUT_WIDTH 2} [get_bd_cells xlslice_0]
create_bd_cell -type module -reference rv32i_ram_datav_wrapper rv32i_ram_datav_wrap_0
create_bd_cell -type module -reference rv32i_load_extender_wrapper rv32i_load_extender_0
create_bd_cell -type ip -vlnv xilinx.com:ip:xlconstant:1.1 xlconstant_1
set_property -dict {CONFIG.CONST_VAL 0} [get_bd_cells xlconstant_1]
create_bd_cell -type module -reference rv32i_mem_stage_wrapper rv32i_mem_stage_wrap_0
create_bd_cell -type module -reference rv32i_mem_wb_reg_wrapper rv32i_mem_wb_reg_wra_0

# ---- hierarchy /RV32I_WB ----
current_bd_instance /RV32I_WB
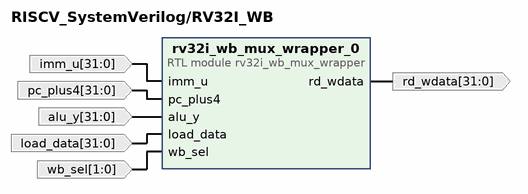
[diagram p5: block diagram inside /RV32I_WB]
create_bd_pin -dir I -from 31 -to 0 imm_u
create_bd_pin -dir I -from 31 -to 0 pc_plus4
create_bd_pin -dir I -from 31 -to 0 alu_y
create_bd_pin -dir I -from 31 -to 0 load_data
create_bd_pin -dir I -from 1 -to 0 wb_sel
create_bd_pin -dir O -from 31 -to 0 rd_wdata

create_bd_cell -type module -reference rv32i_wb_mux_wrapper rv32i_wb_mux_wrapper_0

# ---- hierarchy /RV32I_RESET ----
current_bd_instance /RV32I_RESET
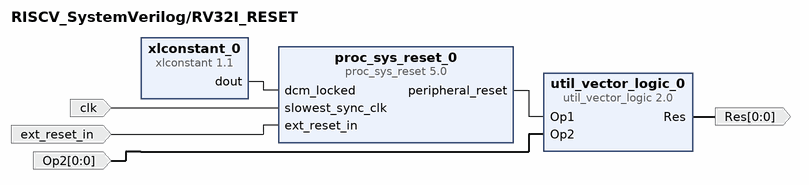
[diagram p6: block diagram inside /RV32I_RESET]
create_bd_pin -dir I -type clk clk
create_bd_pin -dir I -type rst ext_reset_in
create_bd_pin -dir O -from 0 -to 0 Res
create_bd_pin -dir I -from 0 -to 0 Op2

create_bd_cell -type ip -vlnv xilinx.com:ip:xlconstant:1.1 xlconstant_0
create_bd_cell -type ip -vlnv xilinx.com:ip:proc_sys_reset:5.0 proc_sys_reset_0
set_property -dict {CONFIG.C_AUX_RESET_HIGH 0} [get_bd_cells proc_sys_reset_0]
create_bd_cell -type ip -vlnv xilinx.com:ip:util_vector_logic:2.0 util_vector_logic_0
set_property -dict {CONFIG.C_OPERATION or CONFIG.C_SIZE 1} [get_bd_cells util_vector_logic_0]

# ---- connections ----

current_bd_instance /RV32I_IF
connect_bd_net [get_bd_pins util_vector_logic_0/Res] [get_bd_pins util_vector_logic_1/Op1]
connect_bd_net [get_bd_pins pc_unit_wrapper_0/pc] [get_bd_pins pc_to_rom_addr_wrapp_0/pc] [get_bd_pins rv32i_if_id_reg_wrap_0/pc_fetch_in]
connect_bd_net [get_bd_pins pc_to_rom_addr_wrapp_0/a] [get_bd_pins blk_mem_gen_0/addra]
connect_bd_net [get_bd_pins clk] [get_bd_pins blk_mem_gen_0/clka] [get_bd_pins pc_unit_wrapper_0/clk] [get_bd_pins rv32i_if_id_reg_wrap_0/clk]
connect_bd_net [get_bd_pins Hold] [get_bd_pins util_vector_logic_0/Op1] [get_bd_pins rv32i_if_id_reg_wrap_0/hold]
connect_bd_net [get_bd_pins Flush] [get_bd_pins rv32i_if_id_reg_wrap_0/flush]
connect_bd_net [get_bd_pins rv32i_if_id_reg_wrap_0/pc_id_out] [get_bd_pins Pc_id_out]
connect_bd_net [get_bd_pins rv32i_if_id_reg_wrap_0/pc_plus4_id_out] [get_bd_pins Pc_plus4_id_out]
connect_bd_net [get_bd_pins rv32i_if_id_reg_wrap_0/instr_id_out] [get_bd_pins Instr_id_out]
connect_bd_net [get_bd_pins rv32i_if_id_reg_wrap_0/valid_id_out] [get_bd_pins Valid_id_out]
connect_bd_net [get_bd_pins Pc_redirect_valid] [get_bd_pins pc_unit_wrapper_0/pc_redirect_valid]
connect_bd_net [get_bd_pins Pc_redirect_target] [get_bd_pins pc_unit_wrapper_0/pc_redirect_target]
connect_bd_net [get_bd_pins valid_fetch_in] [get_bd_pins rv32i_if_id_reg_wrap_0/valid_fetch_in]
connect_bd_net [get_bd_pins rst] [get_bd_pins pc_unit_wrapper_0/rst] [get_bd_pins rv32i_if_id_reg_wrap_0/rst]
connect_bd_net [get_bd_pins util_vector_logic_1/Res] [get_bd_pins pc_unit_wrapper_0/pc_en]
connect_bd_net -net Op2_1 [get_bd_pins Op2] [get_bd_pins util_vector_logic_1/Op2]
connect_bd_net [get_bd_pins xlconstant_1/dout] [get_bd_pins blk_mem_gen_0/ena]
connect_bd_net [get_bd_pins pc_unit_wrapper_0/pc_plus4] [get_bd_pins rv32i_if_id_reg_wrap_0/pc_plus4_fetch_in]
connect_bd_net [get_bd_pins blk_mem_gen_0/douta] [get_bd_pins rv32i_if_id_reg_wrap_0/instr_rom_in]

current_bd_instance /RV32I_ID
connect_bd_net [get_bd_pins rv32i_decoder_wrapper_0/imm_u] [get_bd_pins rv32i_imm_mux_wrapper_0/imm_u] [get_bd_pins rv32i_id_ex_reg_wrap_0/id_imm_u]
connect_bd_net [get_bd_pins rv32i_decoder_wrapper_0/rs1] [get_bd_pins rv32i_regfile_wrapper_0/rs1_addr] [get_bd_pins rv32i_id_ex_reg_wrap_0/id_rs1]
connect_bd_net [get_bd_pins rv32i_decoder_wrapper_0/rs2] [get_bd_pins rv32i_regfile_wrapper_0/rs2_addr] [get_bd_pins rv32i_id_ex_reg_wrap_0/id_rs2]
connect_bd_net [get_bd_pins rv32i_control_full_w_0/imm_sel] [get_bd_pins rv32i_imm_mux_wrapper_0/imm_sel]
connect_bd_net [get_bd_pins rv32i_decoder_wrapper_0/imm_j] [get_bd_pins rv32i_imm_mux_wrapper_0/imm_j]
connect_bd_net [get_bd_pins rv32i_decoder_wrapper_0/imm_b] [get_bd_pins rv32i_imm_mux_wrapper_0/imm_b]
connect_bd_net [get_bd_pins rv32i_decoder_wrapper_0/imm_s] [get_bd_pins rv32i_imm_mux_wrapper_0/imm_s]
connect_bd_net [get_bd_pins rv32i_decoder_wrapper_0/imm_i] [get_bd_pins rv32i_imm_mux_wrapper_0/imm_i]
connect_bd_net [get_bd_pins rv32i_decoder_wrapper_0/bit30] [get_bd_pins rv32i_control_full_w_0/bit30]
connect_bd_net [get_bd_pins rv32i_decoder_wrapper_0/fmt] [get_bd_pins rv32i_control_full_w_0/fmt]
connect_bd_net [get_bd_pins rv32i_decoder_wrapper_0/funct7] [get_bd_pins rv32i_control_full_w_0/funct7]
connect_bd_net [get_bd_pins rv32i_decoder_wrapper_0/funct3] [get_bd_pins rv32i_control_full_w_0/funct3]
connect_bd_net [get_bd_pins rv32i_decoder_wrapper_0/opcode] [get_bd_pins rv32i_control_full_w_0/opcode]
connect_bd_net [get_bd_pins rv32i_control_full_w_0/wb_sel] [get_bd_pins rv32i_id_ex_reg_wrap_0/id_wb_sel]
connect_bd_net [get_bd_pins rv32i_control_full_w_0/rd_we] [get_bd_pins rv32i_id_ex_reg_wrap_0/id_rd_we]
connect_bd_net [get_bd_pins rv32i_control_full_w_0/lsu_unsigned] [get_bd_pins rv32i_id_ex_reg_wrap_0/id_mem_unsigned]
connect_bd_net [get_bd_pins rv32i_control_full_w_0/lsu_size] [get_bd_pins rv32i_id_ex_reg_wrap_0/id_mem_size]
connect_bd_net [get_bd_pins rv32i_control_full_w_0/mem_we] [get_bd_pins rv32i_id_ex_reg_wrap_0/id_mem_we]
connect_bd_net [get_bd_pins rv32i_control_full_w_0/mem_re] [get_bd_pins rv32i_id_ex_reg_wrap_0/id_mem_re]
connect_bd_net [get_bd_pins rv32i_control_full_w_0/jalr] [get_bd_pins rv32i_id_ex_reg_wrap_0/id_jalr]
connect_bd_net [get_bd_pins rv32i_control_full_w_0/jal] [get_bd_pins rv32i_id_ex_reg_wrap_0/id_jal]
connect_bd_net [get_bd_pins rv32i_control_full_w_0/branch_f3] [get_bd_pins rv32i_id_ex_reg_wrap_0/id_branch_funct3]
connect_bd_net [get_bd_pins rv32i_control_full_w_0/branch_en] [get_bd_pins rv32i_id_ex_reg_wrap_0/id_branch_en]
connect_bd_net [get_bd_pins rv32i_control_full_w_0/opB_sel] [get_bd_pins rv32i_id_ex_reg_wrap_0/id_op_b_sel]
connect_bd_net [get_bd_pins rv32i_control_full_w_0/opA_sel] [get_bd_pins rv32i_id_ex_reg_wrap_0/id_op_a_sel]
connect_bd_net [get_bd_pins rv32i_control_full_w_0/alu_op] [get_bd_pins rv32i_id_ex_reg_wrap_0/id_alu_op]
connect_bd_net [get_bd_pins rv32i_decoder_wrapper_0/rd] [get_bd_pins rv32i_id_ex_reg_wrap_0/id_rd]
connect_bd_net [get_bd_pins rv32i_imm_mux_wrapper_0/imm_out] [get_bd_pins rv32i_id_ex_reg_wrap_0/id_imm]
connect_bd_net [get_bd_pins rv32i_regfile_wrapper_0/rs2_rdata] [get_bd_pins rv32i_id_ex_reg_wrap_0/id_rs2_data]
connect_bd_net [get_bd_pins rv32i_regfile_wrapper_0/rs1_rdata] [get_bd_pins rv32i_id_ex_reg_wrap_0/id_rs1_data]
connect_bd_net [get_bd_pins id_pc] [get_bd_pins rv32i_id_ex_reg_wrap_0/id_pc]
connect_bd_net -net id_pc_plus4_1 [get_bd_pins id_pc_plus4] [get_bd_pins rv32i_id_ex_reg_wrap_0/id_pc_plus4]
connect_bd_net [get_bd_pins instr] [get_bd_pins rv32i_decoder_wrapper_0/instr]
connect_bd_net [get_bd_pins clk] [get_bd_pins rv32i_regfile_wrapper_0/clk] [get_bd_pins rv32i_id_ex_reg_wrap_0/clk]
connect_bd_net [get_bd_pins rst] [get_bd_pins rv32i_id_ex_reg_wrap_0/rst]
connect_bd_net [get_bd_pins rv32i_id_ex_reg_wrap_0/ex_pc_plus4] [get_bd_pins ex_pc_plus4]
connect_bd_net [get_bd_pins rv32i_id_ex_reg_wrap_0/ex_imm_u] [get_bd_pins ex_imm_u]
connect_bd_net [get_bd_pins rv32i_id_ex_reg_wrap_0/ex_rd] [get_bd_pins ex_rd]
connect_bd_net [get_bd_pins rv32i_id_ex_reg_wrap_0/ex_rs1_data] [get_bd_pins ex_rs1_data]
connect_bd_net [get_bd_pins rv32i_id_ex_reg_wrap_0/ex_rs2_data] [get_bd_pins ex_rs2_data]
connect_bd_net [get_bd_pins rv32i_id_ex_reg_wrap_0/ex_pc] [get_bd_pins ex_pc]
connect_bd_net [get_bd_pins rv32i_id_ex_reg_wrap_0/ex_imm] [get_bd_pins ex_imm]
connect_bd_net [get_bd_pins rv32i_id_ex_reg_wrap_0/ex_op_a_sel] [get_bd_pins ex_op_a_sel]
connect_bd_net [get_bd_pins rv32i_id_ex_reg_wrap_0/ex_op_b_sel] [get_bd_pins ex_op_b_sel]
connect_bd_net [get_bd_pins rv32i_id_ex_reg_wrap_0/ex_alu_op] [get_bd_pins ex_alu_op]
connect_bd_net [get_bd_pins rv32i_id_ex_reg_wrap_0/ex_mem_re] [get_bd_pins ex_mem_re]
connect_bd_net [get_bd_pins rv32i_id_ex_reg_wrap_0/ex_mem_we] [get_bd_pins ex_mem_we]
connect_bd_net [get_bd_pins rv32i_id_ex_reg_wrap_0/ex_mem_size] [get_bd_pins ex_mem_size]
connect_bd_net [get_bd_pins rv32i_id_ex_reg_wrap_0/ex_rd_we] [get_bd_pins ex_rd_we]
connect_bd_net [get_bd_pins rv32i_id_ex_reg_wrap_0/ex_mem_unsigned] [get_bd_pins ex_mem_unsigned]
connect_bd_net [get_bd_pins rv32i_id_ex_reg_wrap_0/ex_wb_sel] [get_bd_pins ex_wb_sel]
connect_bd_net [get_bd_pins rv32i_id_ex_reg_wrap_0/ex_jal] [get_bd_pins ex_jal]
connect_bd_net [get_bd_pins rv32i_id_ex_reg_wrap_0/ex_jalr] [get_bd_pins ex_jalr]
connect_bd_net [get_bd_pins rv32i_id_ex_reg_wrap_0/ex_branch_funct3] [get_bd_pins ex_branch_funct3]
connect_bd_net [get_bd_pins rv32i_id_ex_reg_wrap_0/ex_branch_en] [get_bd_pins ex_branch_en]
connect_bd_net [get_bd_pins id_valid] [get_bd_pins rv32i_id_ex_reg_wrap_0/id_valid]
connect_bd_net [get_bd_pins rv32i_id_ex_reg_wrap_0/ex_valid] [get_bd_pins ex_valid]
connect_bd_net [get_bd_pins rd_addr] [get_bd_pins rv32i_regfile_wrapper_0/rd_addr]
connect_bd_net [get_bd_pins rd_wdata] [get_bd_pins rv32i_regfile_wrapper_0/rd_wdata]
connect_bd_net [get_bd_pins rd_we] [get_bd_pins rv32i_regfile_wrapper_0/rd_we]
# net rv32i_hazard_detecti_0_id_ex_flush has one end: id_ex_flush
connect_bd_net [get_bd_pins rv32i_id_ex_reg_wrap_0/ex_rs1] [get_bd_pins ex_rs1]
connect_bd_net [get_bd_pins rv32i_id_ex_reg_wrap_0/ex_rs2] [get_bd_pins ex_rs2]
connect_bd_net [get_bd_pins flush] [get_bd_pins rv32i_id_ex_reg_wrap_0/bubble]
connect_bd_net [get_bd_pins stall] [get_bd_pins rv32i_id_ex_reg_wrap_0/stall]

current_bd_instance /RV32I_EX
connect_bd_net [get_bd_pins rv32i_alu_wrapper_0/y] [get_bd_pins rv32i_ex_mem_reg_wra_0/ex_alu_result]
connect_bd_net -net RV32I_ID_ex_pc [get_bd_pins ex_pc] [get_bd_pins rv32i_branch_unit_wr_0/ex_pc] [get_bd_pins rv32i_ex_mem_reg_wra_0/ex_pc]
connect_bd_net [get_bd_pins clk] [get_bd_pins rv32i_ex_mem_reg_wra_0/clk]
connect_bd_net [get_bd_pins rst] [get_bd_pins rv32i_ex_mem_reg_wra_0/rst]
connect_bd_net [get_bd_pins ex_valid] [get_bd_pins rv32i_branch_unit_wr_0/ex_valid] [get_bd_pins rv32i_ex_mem_reg_wra_0/ex_valid]
connect_bd_net [get_bd_pins rs2_data] [get_bd_pins rv32i_ex_mem_reg_wra_0/ex_store_data]
connect_bd_net -net RV32I_ID_ex_pc_plus4 [get_bd_pins ex_pc_plus4] [get_bd_pins rv32i_ex_mem_reg_wra_0/ex_pc_plus4]
connect_bd_net -net RV32I_ID_ex_imm_u [get_bd_pins ex_imm_u] [get_bd_pins rv32i_ex_mem_reg_wra_0/ex_imm_u]
connect_bd_net -net RV32I_ID_ex_rd [get_bd_pins ex_rd] [get_bd_pins rv32i_ex_mem_reg_wra_0/ex_rd]
connect_bd_net -net RV32I_ID_ex_mem_re [get_bd_pins ex_mem_re] [get_bd_pins rv32i_ex_mem_reg_wra_0/ex_mem_re]
connect_bd_net -net RV32I_ID_ex_mem_we [get_bd_pins ex_mem_we] [get_bd_pins rv32i_ex_mem_reg_wra_0/ex_mem_we]
connect_bd_net -net RV32I_ID_ex_mem_size [get_bd_pins ex_mem_size] [get_bd_pins rv32i_ex_mem_reg_wra_0/ex_mem_size]
connect_bd_net -net RV32I_ID_ex_mem_unsigned [get_bd_pins ex_mem_unsigned] [get_bd_pins rv32i_ex_mem_reg_wra_0/ex_mem_unsigned]
connect_bd_net -net RV32I_ID_ex_rd_we [get_bd_pins ex_rd_we] [get_bd_pins rv32i_ex_mem_reg_wra_0/ex_rd_we]
connect_bd_net -net RV32I_ID_ex_wb_sel [get_bd_pins ex_wb_sel] [get_bd_pins rv32i_ex_mem_reg_wra_0/ex_wb_sel]
connect_bd_net -net RV32I_ID_ex_imm [get_bd_pins imm] [get_bd_pins rv32i_branch_unit_wr_0/ex_imm]
connect_bd_net -net RV32I_ID_ex_branch_en [get_bd_pins ex_branch_en] [get_bd_pins rv32i_branch_unit_wr_0/ex_branch_en]
connect_bd_net -net RV32I_ID_ex_branch_funct3 [get_bd_pins ex_branch_funct3] [get_bd_pins rv32i_branch_unit_wr_0/ex_branch_funct3]
connect_bd_net -net RV32I_ID_ex_jal [get_bd_pins ex_jal] [get_bd_pins rv32i_branch_unit_wr_0/ex_jal]
connect_bd_net -net RV32I_ID_ex_jalr [get_bd_pins ex_jalr] [get_bd_pins rv32i_branch_unit_wr_0/ex_jalr]
connect_bd_net -net RV32I_ID_ex_alu_op [get_bd_pins alu_op] [get_bd_pins rv32i_alu_wrapper_0/alu_op]
connect_bd_net [get_bd_pins rv32i_branch_unit_wr_0/pc_redirect_valid] [get_bd_pins pc_redirect_valid]
connect_bd_net [get_bd_pins rv32i_branch_unit_wr_0/pc_redirect_target] [get_bd_pins pc_redirect_target]
connect_bd_net [get_bd_pins rv32i_ex_mem_reg_wra_0/mem_pc_plus4] [get_bd_pins mem_pc_plus4]
connect_bd_net [get_bd_pins rv32i_ex_mem_reg_wra_0/mem_rd] [get_bd_pins mem_rd]
connect_bd_net [get_bd_pins rv32i_ex_mem_reg_wra_0/mem_mem_re] [get_bd_pins mem_mem_re]
connect_bd_net [get_bd_pins rv32i_ex_mem_reg_wra_0/mem_mem_we] [get_bd_pins mem_mem_we]
connect_bd_net [get_bd_pins rv32i_ex_mem_reg_wra_0/mem_mem_size] [get_bd_pins mem_mem_size]
connect_bd_net [get_bd_pins rv32i_ex_mem_reg_wra_0/mem_mem_unsigned] [get_bd_pins mem_mem_unsigned]
connect_bd_net [get_bd_pins rv32i_ex_mem_reg_wra_0/mem_rd_we] [get_bd_pins mem_rd_we]
connect_bd_net [get_bd_pins rv32i_ex_mem_reg_wra_0/mem_wb_sel] [get_bd_pins mem_wb_sel]
connect_bd_net [get_bd_pins rv32i_ex_mem_reg_wra_0/mem_imm_u] [get_bd_pins mem_imm_u]
connect_bd_net [get_bd_pins rv32i_ex_mem_reg_wra_0/mem_store_data] [get_bd_pins mem_store_data]
connect_bd_net [get_bd_pins rv32i_ex_mem_reg_wra_0/mem_alu_result] [get_bd_pins mem_alu_result]
connect_bd_net [get_bd_pins rv32i_branch_unit_wr_0/ex_flush_req] [get_bd_pins ex_flush_req]
connect_bd_net -net rv32i_forward_mux_wr_0_out_data [get_bd_pins rv32i_alu_wrapper_0/a] [get_bd_pins rv32i_branch_unit_wr_0/ex_rs1_data]
# net mem_wb_data_1 has one end: mem_wb_data
connect_bd_net -net rv32i_forward_mux_wr_1_out_data [get_bd_pins rv32i_alu_wrapper_0/b] [get_bd_pins rv32i_branch_unit_wr_0/ex_rs2_data]
# net ex_rs1_1 has one end: ex_rs1
# net ex_rs2_1 has one end: ex_rs2
# net wb_rd_1 has one end: wb_rd
# net wb_rd_we_1 has one end: wb_rd_we
connect_bd_net [get_bd_pins xlconstant_1/dout] [get_bd_pins rv32i_ex_mem_reg_wra_0/stall] [get_bd_pins rv32i_ex_mem_reg_wra_0/flush]
connect_bd_net [get_bd_pins rv32i_ex_mem_reg_wra_0/mem_valid] [get_bd_pins mem_valid]
# net mem_rd_we1_1 has one end: mem_rd_we1

current_bd_instance /RV32I_MEM
connect_bd_net [get_bd_pins clk] \
  [get_bd_pins rv32i_ram_datav_wrap_0/clk] [get_bd_pins rv32i_mem_stage_wrap_0/clk] [get_bd_pins rv32i_mem_wb_reg_wra_0/clk]
connect_bd_net [get_bd_pins rv32i_mem_stage_wrap_0/dmem_we] [get_bd_pins rv32i_ram_datav_wrap_0/we]
connect_bd_net [get_bd_pins rv32i_mem_stage_wrap_0/dmem_be] [get_bd_pins rv32i_ram_datav_wrap_0/be]
connect_bd_net [get_bd_pins rv32i_mem_stage_wrap_0/dmem_addr] [get_bd_pins xlslice_0/Din] [get_bd_pins rv32i_ram_datav_wrap_0/addr]
connect_bd_net [get_bd_pins rv32i_mem_stage_wrap_0/dmem_wdata] [get_bd_pins rv32i_ram_datav_wrap_0/wdata]
connect_bd_net [get_bd_pins rv32i_ram_datav_wrap_0/rdata] [get_bd_pins rv32i_load_extender_0/mem_data] [get_bd_pins rv32i_mem_stage_wrap_0/dmem_rdata]
connect_bd_net [get_bd_pins xlslice_0/Dout] [get_bd_pins rv32i_load_extender_0/addr_offset]
connect_bd_net [get_bd_pins rv32i_load_extender_0/load_data] [get_bd_pins rv32i_mem_wb_reg_wra_0/mem_data]
connect_bd_net [get_bd_pins rst] [get_bd_pins rv32i_mem_stage_wrap_0/rst] [get_bd_pins rv32i_mem_wb_reg_wra_0/rst]
connect_bd_net [get_bd_pins rv32i_mem_stage_wrap_0/wb_alu_result] [get_bd_pins rv32i_mem_wb_reg_wra_0/mem_alu_result]
connect_bd_net [get_bd_pins rv32i_mem_stage_wrap_0/wb_pc_plus4] [get_bd_pins rv32i_mem_wb_reg_wra_0/mem_pc_plus4]
connect_bd_net [get_bd_pins rv32i_mem_stage_wrap_0/wb_imm_u] [get_bd_pins rv32i_mem_wb_reg_wra_0/mem_imm_u]
connect_bd_net [get_bd_pins rv32i_mem_stage_wrap_0/wb_rd] [get_bd_pins rv32i_mem_wb_reg_wra_0/mem_rd]
connect_bd_net [get_bd_pins rv32i_mem_stage_wrap_0/wb_rd_we] [get_bd_pins rv32i_mem_wb_reg_wra_0/mem_rd_we]
connect_bd_net [get_bd_pins rv32i_mem_stage_wrap_0/wb_sel] [get_bd_pins rv32i_mem_wb_reg_wra_0/mem_wb_sel]
connect_bd_net -net RV32I_EX_mem_alu_result [get_bd_pins mem_alu_result] [get_bd_pins rv32i_mem_stage_wrap_0/mem_alu_result]
connect_bd_net -net RV32I_EX_mem_store_data [get_bd_pins mem_store_data] [get_bd_pins rv32i_mem_stage_wrap_0/mem_store_data]
connect_bd_net -net RV32I_EX_mem_pc_plus4 [get_bd_pins mem_pc_plus4] [get_bd_pins rv32i_mem_stage_wrap_0/mem_pc_plus4]
connect_bd_net -net RV32I_EX_mem_imm_u [get_bd_pins mem_imm_u] [get_bd_pins rv32i_mem_stage_wrap_0/mem_imm_u]
connect_bd_net -net RV32I_EX_mem_rd [get_bd_pins mem_rd] [get_bd_pins rv32i_mem_stage_wrap_0/mem_rd]
connect_bd_net -net RV32I_EX_mem_rd_we [get_bd_pins mem_rd_we] [get_bd_pins rv32i_mem_stage_wrap_0/mem_rd_we]
connect_bd_net -net RV32I_EX_mem_mem_re [get_bd_pins mem_mem_re] [get_bd_pins rv32i_mem_stage_wrap_0/mem_mem_re]
connect_bd_net -net RV32I_EX_mem_mem_we [get_bd_pins mem_mem_we] [get_bd_pins rv32i_mem_stage_wrap_0/mem_mem_we]
connect_bd_net -net RV32I_EX_mem_mem_size [get_bd_pins mem_mem_size] \
  [get_bd_pins rv32i_load_extender_0/size] [get_bd_pins rv32i_mem_stage_wrap_0/mem_mem_size]
connect_bd_net -net RV32I_EX_mem_mem_unsigned [get_bd_pins mem_mem_unsigned] \
  [get_bd_pins rv32i_load_extender_0/unsigned_load] [get_bd_pins rv32i_mem_stage_wrap_0/mem_mem_unsigned]
connect_bd_net -net RV32I_EX_mem_wb_sel [get_bd_pins mem_wb_sel] [get_bd_pins rv32i_mem_stage_wrap_0/mem_wb_sel]
connect_bd_net [get_bd_pins rv32i_mem_wb_reg_wra_0/wb_imm_u] [get_bd_pins wb_imm_u]
connect_bd_net [get_bd_pins rv32i_mem_wb_reg_wra_0/wb_pc_plus4] [get_bd_pins wb_pc_plus4]
connect_bd_net [get_bd_pins rv32i_mem_wb_reg_wra_0/wb_alu_result] [get_bd_pins wb_alu_result]
connect_bd_net [get_bd_pins rv32i_mem_wb_reg_wra_0/wb_data] [get_bd_pins wb_data]
connect_bd_net [get_bd_pins rv32i_mem_wb_reg_wra_0/wb_sel] [get_bd_pins wb_sel]
connect_bd_net [get_bd_pins rv32i_mem_wb_reg_wra_0/wb_rd] [get_bd_pins wb_rd]
connect_bd_net [get_bd_pins rv32i_mem_wb_reg_wra_0/wb_rd_we] [get_bd_pins wb_rd_we]
connect_bd_net [get_bd_pins xlconstant_1/dout] [get_bd_pins rv32i_mem_wb_reg_wra_0/stall] [get_bd_pins rv32i_mem_wb_reg_wra_0/flush]
connect_bd_net [get_bd_pins mem_valid] [get_bd_pins rv32i_mem_stage_wrap_0/mem_valid]
connect_bd_net [get_bd_pins rv32i_mem_stage_wrap_0/wb_valid] [get_bd_pins rv32i_mem_wb_reg_wra_0/mem_valid]
connect_bd_net [get_bd_pins rv32i_mem_wb_reg_wra_0/wb_valid] [get_bd_pins wb_valid]

current_bd_instance /RV32I_WB
connect_bd_net [get_bd_pins imm_u] [get_bd_pins rv32i_wb_mux_wrapper_0/imm_u]
connect_bd_net -net pc_plus4_1 [get_bd_pins pc_plus4] [get_bd_pins rv32i_wb_mux_wrapper_0/pc_plus4]
connect_bd_net [get_bd_pins alu_y] [get_bd_pins rv32i_wb_mux_wrapper_0/alu_y]
connect_bd_net [get_bd_pins load_data] [get_bd_pins rv32i_wb_mux_wrapper_0/load_data]
connect_bd_net [get_bd_pins wb_sel] [get_bd_pins rv32i_wb_mux_wrapper_0/wb_sel]
connect_bd_net [get_bd_pins rv32i_wb_mux_wrapper_0/rd_wdata] [get_bd_pins rd_wdata]

current_bd_instance /RV32I_RESET
connect_bd_net [get_bd_pins xlconstant_0/dout] [get_bd_pins proc_sys_reset_0/dcm_locked]
connect_bd_net [get_bd_pins proc_sys_reset_0/peripheral_reset] [get_bd_pins util_vector_logic_0/Op1]
connect_bd_net -net zynq_ultra_ps_e_1_pl_clk0 [get_bd_pins clk] [get_bd_pins proc_sys_reset_0/slowest_sync_clk]
connect_bd_net -net zynq_ultra_ps_e_1_pl_resetn0 [get_bd_pins ext_reset_in] [get_bd_pins proc_sys_reset_0/ext_reset_in]
connect_bd_net [get_bd_pins util_vector_logic_0/Res] [get_bd_pins Res]
connect_bd_net -net Op2_1 [get_bd_pins Op2] [get_bd_pins util_vector_logic_0/Op2]

current_bd_instance /
connect_bd_net [get_bd_pins RV32I_IF/Pc_id_out] [get_bd_pins RV32I_ID/id_pc]
connect_bd_net [get_bd_pins RV32I_IF/Pc_plus4_id_out] [get_bd_pins RV32I_ID/id_pc_plus4]
connect_bd_net [get_bd_pins RV32I_IF/Instr_id_out] [get_bd_pins RV32I_ID/instr]
connect_bd_net -net rst_1 [get_bd_pins RV32I_RESET/Res] \
  [get_bd_pins RV32I_IF/rst] [get_bd_pins RV32I_ID/rst] [get_bd_pins RV32I_EX/rst] [get_bd_pins RV32I_MEM/rst]
connect_bd_net [get_bd_pins RV32I_ID/ex_rs2_data] [get_bd_pins RV32I_EX/rs2_data]
connect_bd_net [get_bd_pins RV32I_ID/ex_pc_plus4] [get_bd_pins RV32I_EX/ex_pc_plus4]
connect_bd_net [get_bd_pins RV32I_ID/ex_imm_u] [get_bd_pins RV32I_EX/ex_imm_u]
connect_bd_net [get_bd_pins RV32I_ID/ex_rd] [get_bd_pins RV32I_EX/ex_rd]
connect_bd_net [get_bd_pins RV32I_ID/ex_rs1_data] [get_bd_pins RV32I_EX/ex_rs1_data]
connect_bd_net [get_bd_pins RV32I_ID/ex_pc] [get_bd_pins RV32I_EX/ex_pc]
connect_bd_net [get_bd_pins RV32I_ID/ex_imm] [get_bd_pins RV32I_EX/imm]
connect_bd_net [get_bd_pins RV32I_ID/ex_op_a_sel] [get_bd_pins RV32I_EX/op_a_sel]
connect_bd_net [get_bd_pins RV32I_ID/ex_op_b_sel] [get_bd_pins RV32I_EX/op_b_sel]
connect_bd_net [get_bd_pins RV32I_ID/ex_alu_op] [get_bd_pins RV32I_EX/alu_op]
connect_bd_net [get_bd_pins RV32I_ID/ex_mem_re] [get_bd_pins RV32I_EX/ex_mem_re]
connect_bd_net [get_bd_pins RV32I_ID/ex_mem_we] [get_bd_pins RV32I_EX/ex_mem_we]
connect_bd_net [get_bd_pins RV32I_ID/ex_mem_size] [get_bd_pins RV32I_EX/ex_mem_size]
connect_bd_net [get_bd_pins RV32I_ID/ex_rd_we] [get_bd_pins RV32I_EX/ex_rd_we]
connect_bd_net [get_bd_pins RV32I_ID/ex_mem_unsigned] [get_bd_pins RV32I_EX/ex_mem_unsigned]
connect_bd_net [get_bd_pins RV32I_ID/ex_wb_sel] [get_bd_pins RV32I_EX/ex_wb_sel]
connect_bd_net [get_bd_pins RV32I_ID/ex_jal] [get_bd_pins RV32I_EX/ex_jal]
connect_bd_net [get_bd_pins RV32I_ID/ex_jalr] [get_bd_pins RV32I_EX/ex_jalr]
connect_bd_net [get_bd_pins RV32I_ID/ex_branch_funct3] [get_bd_pins RV32I_EX/ex_branch_funct3]
connect_bd_net [get_bd_pins RV32I_ID/ex_branch_en] [get_bd_pins RV32I_EX/ex_branch_en]
connect_bd_net [get_bd_pins RV32I_ID/ex_valid] [get_bd_pins RV32I_EX/ex_valid]
connect_bd_net [get_bd_pins xlconstant_0/dout] [get_bd_pins RV32I_IF/valid_fetch_in]
connect_bd_net [get_bd_pins RV32I_IF/Valid_id_out] [get_bd_pins RV32I_ID/id_valid]
connect_bd_net -net Pc_redirect_valid_1 [get_bd_pins RV32I_EX/pc_redirect_valid] [get_bd_pins RV32I_IF/Pc_redirect_valid]
connect_bd_net -net Pc_redirect_target_1 [get_bd_pins RV32I_EX/pc_redirect_target] [get_bd_pins RV32I_IF/Pc_redirect_target]
connect_bd_net [get_bd_pins RV32I_EX/mem_pc_plus4] [get_bd_pins RV32I_MEM/mem_pc_plus4]
connect_bd_net [get_bd_pins RV32I_EX/mem_rd] [get_bd_pins RV32I_MEM/mem_rd]
connect_bd_net [get_bd_pins RV32I_EX/mem_mem_re] [get_bd_pins RV32I_MEM/mem_mem_re]
connect_bd_net [get_bd_pins RV32I_EX/mem_mem_we] [get_bd_pins RV32I_MEM/mem_mem_we]
connect_bd_net [get_bd_pins RV32I_EX/mem_mem_size] [get_bd_pins RV32I_MEM/mem_mem_size]
connect_bd_net [get_bd_pins RV32I_EX/mem_mem_unsigned] [get_bd_pins RV32I_MEM/mem_mem_unsigned]
connect_bd_net [get_bd_pins RV32I_EX/mem_rd_we] [get_bd_pins RV32I_MEM/mem_rd_we] [get_bd_pins util_vector_logic_4/Op2]
connect_bd_net [get_bd_pins RV32I_EX/mem_wb_sel] [get_bd_pins RV32I_MEM/mem_wb_sel]
connect_bd_net [get_bd_pins RV32I_EX/mem_imm_u] [get_bd_pins RV32I_MEM/mem_imm_u]
connect_bd_net [get_bd_pins RV32I_EX/mem_store_data] [get_bd_pins RV32I_MEM/mem_store_data]
connect_bd_net [get_bd_pins RV32I_EX/mem_alu_result] [get_bd_pins RV32I_MEM/mem_alu_result]
connect_bd_net [get_bd_pins zynq_ultra_ps_e_1/pl_clk0] \
  [get_bd_pins zynq_ultra_ps_e_1/maxihpm0_fpd_aclk] [get_bd_pins RV32I_RESET/clk] [get_bd_pins RV32I_IF/clk] \
  [get_bd_pins RV32I_ID/clk] [get_bd_pins RV32I_EX/clk] [get_bd_pins RV32I_MEM/clk] [get_bd_pins vio_0/clk]
connect_bd_net [get_bd_pins zynq_ultra_ps_e_1/pl_resetn0] [get_bd_pins RV32I_RESET/ext_reset_in]
connect_bd_net [get_bd_pins RV32I_MEM/wb_imm_u] [get_bd_pins RV32I_WB/imm_u]
connect_bd_net [get_bd_pins RV32I_MEM/wb_pc_plus4] [get_bd_pins RV32I_WB/pc_plus4]
connect_bd_net [get_bd_pins RV32I_MEM/wb_alu_result] [get_bd_pins RV32I_WB/alu_y]
connect_bd_net [get_bd_pins RV32I_MEM/wb_data] [get_bd_pins RV32I_WB/load_data]
connect_bd_net [get_bd_pins RV32I_MEM/wb_sel] [get_bd_pins RV32I_WB/wb_sel]
connect_bd_net -net Flush_1 [get_bd_pins RV32I_EX/ex_flush_req] [get_bd_pins RV32I_IF/Flush] [get_bd_pins util_vector_logic_1/Op2]
connect_bd_net [get_bd_pins RV32I_MEM/wb_rd] [get_bd_pins RV32I_ID/rd_addr] [get_bd_pins RV32I_EX/wb_rd]
connect_bd_net [get_bd_pins RV32I_WB/rd_wdata] [get_bd_pins RV32I_ID/rd_wdata] [get_bd_pins RV32I_EX/mem_wb_data]
connect_bd_net -net rd_we_1 [get_bd_pins RV32I_MEM/wb_rd_we] [get_bd_pins util_vector_logic_2/Op2] [get_bd_pins util_vector_logic_3/Op1]
connect_bd_net [get_bd_pins RV32I_ID/id_ex_flush] [get_bd_pins util_vector_logic_1/Op1]
connect_bd_net [get_bd_pins RV32I_ID/ex_rs1] [get_bd_pins RV32I_EX/ex_rs1]
connect_bd_net -net ex_rs2_1 [get_bd_pins RV32I_ID/ex_rs2] [get_bd_pins RV32I_EX/ex_rs2]
connect_bd_net [get_bd_pins vio_0/probe_out0] [get_bd_pins RV32I_RESET/Op2]
connect_bd_net [get_bd_pins RV32I_EX/mem_valid] [get_bd_pins RV32I_MEM/mem_valid] [get_bd_pins util_vector_logic_4/Op1]
connect_bd_net [get_bd_pins RV32I_MEM/wb_valid] [get_bd_pins util_vector_logic_2/Op1] [get_bd_pins util_vector_logic_3/Op2]
connect_bd_net [get_bd_pins util_vector_logic_2/Res] [get_bd_pins RV32I_ID/rd_we]
connect_bd_net [get_bd_pins util_vector_logic_3/Res] [get_bd_pins RV32I_EX/wb_rd_we]
connect_bd_net [get_bd_pins util_vector_logic_4/Res] [get_bd_pins RV32I_EX/mem_rd_we1]
connect_bd_net -net flush_2 [get_bd_pins util_vector_logic_1/Res] [get_bd_pins RV32I_ID/flush]
connect_bd_net [get_bd_pins xlconstant_1/dout] [get_bd_pins RV32I_IF/Hold]

validate_bd_design
save_bd_design
